# Altium schematic sheet Sheet1.SchDoc: DIY Supercapacitor Spot Welder – Inspired by AKA KASYAN, Modified Design
size A4; Author: Hisham2630; DrawnBy: Hisham2630; Engineer: Hisham2630; Revision: A; SheetNumber: 1; SheetTotal: 1
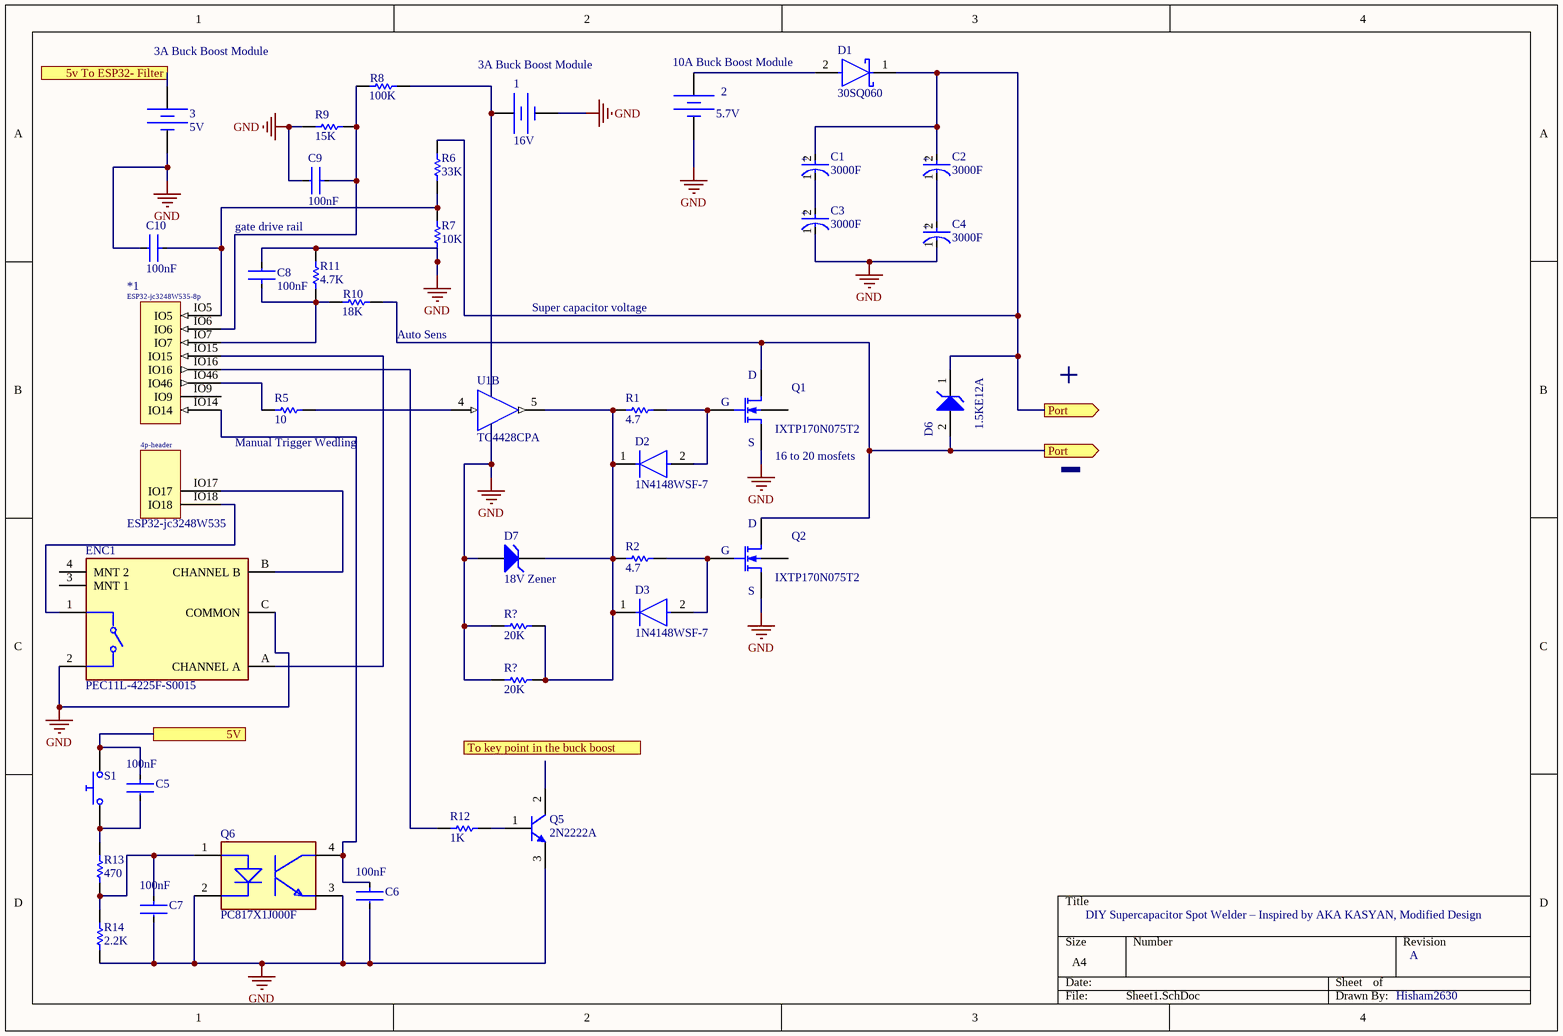
[diagram p0: Sheet1.SchDoc]

## Parts
(Parts that share a designator on the sheet are numbered #1, #2 ... from top to bottom, then left to right.)
1  3A Buck Boost Module  DC Magnitude: 16V
2  10A Buck Boost Module  DC Magnitude: 5.7V
3  3A Buck Boost Module  DC Magnitude: 5V
*1  ESP32-jc3248W535
C1  3000F  [FP-FT0H474ZF-MFG]
C2  3000F  [FP-FT0H474ZF-MFG]
C3  3000F  [FP-FT0H474ZF-MFG]
C4  3000F  [FP-FT0H474ZF-MFG]
C5  Capacitance: 100nF  [FP-GRM033-0_03-IPC_C]
C6  Capacitance: 100nF  [FP-GRM033-0_03-IPC_C]
C7  Capacitance: 100nF  [FP-GRM033-0_03-IPC_C]
C8  Capacitance: 100nF  [FP-GRM033-0_03-IPC_C]
C9  Capacitance: 100nF  [FP-GRM033-0_03-IPC_C]
C10  Capacitance: 100nF  [FP-GRM033-0_03-IPC_C]
D1  30SQ060  [FP-SMAF-MFG]
D2  1N4148WSF-7  [FP-SOD323F-MFG]
D3  1N4148WSF-7  [FP-SOD323F-MFG]
D6  1.5KE12A  [WE-TVSP_DO-214AA_Unidirectional]
D7  BV: 18V Zener  (hidden comment: Zener Diode)
ENC1  PEC11L-4225F-S0015  [FP-PEC11L-4225F-S0015-MFG]
Q1  IXTP170N075T2
Q2  IXTP170N075T2
Q5  2N2222A  [STM-TO-18-3]
Q6  PC817X1J000F  [FP-PC817X1J000F-MFG]
R1  value 4.7  (hidden comment: Resistor)
R2  value 4.7  (hidden comment: Resistor)
R5  value 10  (hidden comment: Resistor)
R6  value 33K  (hidden comment: Resistor)
R7  value 10K  (hidden comment: Resistor)
R8  value 100K  (hidden comment: Resistor)
R9  value 15K  (hidden comment: Resistor)
R10  value 18K  (hidden comment: Resistor)
R11  value 4.7K  (hidden comment: Resistor)
R12  value 1K  (hidden comment: Resistor)
R13  value 470  (hidden comment: Resistor)
R14  value 2.2K  (hidden comment: Resistor)
R?#1  value 20K  (hidden comment: Resistor)
R?#2  value 20K  (hidden comment: Resistor)
S1  Push Button Normally Opened  (value not drawn)
U1  TC4428CPA  [PDIP300-PA8]  (part B of 3)

## Ports
5V, 5v To ESP32- Filter, Port (out, see Sheet1[3B]), To key point in the buck boost

## Nets
GND: 1.2 2.2 3.2 C3.1(C) C4.1(C) C6.2 C7.2 C8.2 C9.2 C10.2 D7.1(A) ENC1.2 ENC1.C(COMMON) Q1.3(S) Q2.3(S) Q5.3(E) Q6.2(C) Q6.3(E) R7.1 R9.2 R11.2 R14.1 R?#1.1 R?#2.1
5V: C5.1 S1.2 ; port 5V
5v To ESP32- Filter: 3.1 ; port 5v To ESP32- Filter
Port: C1.2(A) C2.2(A) D1.1(C) D6.1(K) D6.2(A) Q1.1(D) Q2.1(D) R6.2 R10.2 ; port Port
Net1_1: 1.1 R8.2
Net2_1: 2.1 D1.2(A)
Net*1_IO5: *1.IO5 C10.1 R6.1 R7.2
Net*1_IO6: *1.IO6 C9.1 R8.1 R9.1
Net*1_IO7: *1.IO7 C8.1 R10.1 R11.1
Net*1_IO14: *1.IO14 C6.1 Q6.4(C)
Net*1_IO15: *1.IO15 ENC1.A(CHANNEL_A)
Net*1_IO16: *1.IO16 R12.1
Net*1_IO17: *1.IO17 ENC1.B(CHANNEL_B)
Net*1_IO18: *1.IO18 ENC1.1
Net*1_IO46: *1.IO46 R5.1
NetC1_1: C1.1(C) C3.2(A)
NetC2_1: C2.1(C) C4.2(A)
NetC5_2: C5.2 R13.2 S1.1
NetC7_1: C7.1 Q6.1(A) R13.1 R14.2
NetD2_1: D2.1(C) D3.1(C) D7.2(K) R1.1 R2.1 R?#1.2 R?#2.2 U1.5(OUTB)
NetD2_2: D2.2(A) Q1.2(G) R1.2
NetD3_2: D3.2(A) Q2.2(G) R2.2
NetQ5_1: Q5.1(B) R12.2
NetR5_2: R5.2 U1.4(INB)

Not connected (* = marked no-connect by the designer): *1 IO9; ENC1 3(MNT_1) 4(MNT_2); Q1 4(B); Q2 4(B); Q5 2(C)

## Notes on the sheet
- gate drive rail
- Super capacitor voltage
- (near R10) Auto Sens
- (near Q1) D
- (near R5) Manual Trigger Wedling
- (near Q1) G
- (near Q1) S
- +
- (near Q1) 16 to 20 mosfets
- -
- (near Q2) G
- (near Q2) D
- (near Q2) S
- (in symbol CMP-03024-000001-1) +
- (in symbol ESP32-jc3248W535) ESP32-jc3248W535-8p; 4p-header

## Library data of the parts
1-3 = Battery: Constant Voltage Source; SimulationGenericComponent: True
C1-C4 = CMP-03024-000001-1: CAP 470MF -20% +80% 5.5V T/H; Manufacturer: KEMET; Manufacturer Part Number: FT0H474ZF; Capacitance: 0.47F; Tolerance: -20/+80%; Value: 0.47F; Octopart: https://octopart.com/ft0h474zf-kemet-30531665; Automotive: No; Device Class L3: Supercapacitors; Digikey Description: CAP 470MF -20% +80% 5.5V T/H; ComponentLink2Description: Datasheet; ComponentLink2URL: https://content.kemet.com/datasheets/KEM_S6014_FT.pdf; Device Class L1: Passive Components; Height: 13mm; Category: Cap; RoHS: TRUE; Lead Free: Yes; Temperature Range Low: -40°C; Temperature: -40°C to +85°C; Voltage Rating: 5.5V; Device Class L2: Capacitors; Package: FT0H474ZF; Mouser Description: Supercapacitors / Ultracapacitors 0.47F 5.5volts Radial Super Cap; Temperature Range High: +85°C
C5-C10 = CMP-2010-01264-2: Chip Multilayer Ceramic Capacitors for General Purpose, 0201, 0.10uF, X5R, 15%, 10%, 10V; Mount: Surface Mount; Dielectric: X5R; Width: 0.012inch; Tolerance: 10%; Radiation Hardening: No; Voltage Rating: 10V; REACH SVHC: No SVHC; Height: 0.3mm; Max Operating Temperature: 85°C; Voltage Rating (DC): 10V; Thickness: 0.013inch; Termination: SMD/SMT; Lead Free: Lead Free; Package Quantity: 1; Case/Package: 0201; Min Operating Temperature: -55°C; Weight: 6E-06oz; Length: 0.6mm; Case Code (Imperial): 0201; Depth: 0.3mm; Voltage: 10V; Packaging: Tape and Reel; Case Code (Metric): 0603
D1 = CMP-12790-000092-1: DIODE SCHOTTKY 20V 1A SMAF; Average Rectified Current: 1A; Packaging: Tape and Reel; Mount: Surface Mount; Max Reverse Voltage (DC): 20V; RoHS Compliant: Yes
D2 D3 = CMP-12791-000029-1: DIODE GEN PURP 100V 250MA SOD323; Manufacturer: Diodes Inc.; Value: 1.5pF; Max Surge Forward Current: 0.5A; Peak Reverse Current: 0.5uA; Max Junction Temp: +150°C; Height: 0.75mm; Digikey Description: DIODE GEN PURP 100V 250MA SOD323; Automotive: No; Footprint Url: https://www.diodes.com/assets/Package-Files/SOD323F.pdf; Category: Diode; Manufacturer Part Number: 1N4148WSF-7; Max Repetitive Reverse Voltage: 100V; Lead Free: Yes; Temperature Range High: +150°C; Forward Current: 250mA; Reverse Voltage: 100V; Device Class L3: Rectifier Diodes; ComponentLink2URL: https://www.diodes.com/assets/Datasheets/1N4148WSF.pdf; Package: SOD323F; RoHS: TRUE; Mouser Description: Diodes - General Purpose, Power, Switching 200mW 2pF 75Vrrm 150mA 2A 1VF; Temperature: -55°C to +150°C; Capacitance: 1.5pF; Device Class L2: Diodes; ComponentLink2Description: Datasheet; Device Class L1: Discrete Semiconductors; Octopart: https://octopart.com/1n4148wsf-7-diodes+inc.-33798544; Temperature Range Low: -55°C
D6 = CMP-03913-71101605-2: TVS diode [Würth Elektronik] 824520700 TVS diode; Min Breakdown Voltage: 8.19V; Peak Pulse Current: 50A; Reverse Standoff Voltage: 7V; Power Line Protection: No; Number of Unidirectional Channels: 1; Polarity: Unidirectional; Peak Pulse Power: 600W; Leakage Current: 200µA; Clamping Voltage: 12V; Packaging: Cut Tape; Length: 4.32mm; Number of Pins: 2; Width: 3.62mm; Height: 2.4mm; REACH SVHC: Unknown; Breakdown Voltage: 8.19V; RoHS: Compliant; Composition: Zener; Mount: Surface Mount; Max Operating Temperature: 150°C; Min Operating Temperature: -65°C; Max Breakdown Voltage: 8.19V
D7 = Zener Diode: AF: 1; BV_MAX: 1e99; CJO: 0; EG: 1.11; FC: 0.5; IBV: 0.001; IS: 1e-14; MJSW: 0.33; NTUN: 30; TNOM: 27; XTI: 3; SimulationGenericComponent: True; CJP: 0; CTA: 0; CTP: 0; FCS: 0.5; FV_MAX: 1e99; IKF: 0; IKR: 0; ISR: 1e-14; JSW: 0; JTUN: 0; JTUNSW: 0; KEG: 1; KF: 0; LEVEL: 1; N: 1; NBV: 1; NR: 1; NS: 1; PHP: 1; RS: 0; TCV: 0; TLEV: 0; TLEVC: 0; TM1: 0; TM2: 0; TPB: 0; TPHP: 0; TRS: 0; TRS2: 0; TT: 0; TTT1: 0; TTT2: 0; VJ: 1; XTITUN: 3
ENC1 = CMP-07421-000017-1: ROTARY ENCODER MECHANICAL 15PPR; Capacitance: 4225F; Pulses per Revolution: 15; Built in Switch: Yes; Number of Channels: 2; Output Type: Quadrature; Length: 29.5mm; Height: 12mm; RoHS Compliant: Yes; Min Operating Temperature: -25°C; Package Quantity: 75; Detent: Yes; Encoder Type: Mechanical; Mount: Through Hole; Max Operating Temperature: 80°C; Orientation: Vertical; Termination: PC Pin; Width: 11.8mm; Packaging: Bulk
Q1 Q2 = MOSFET N-ch Lev1: N-channel MOS1 MOSFET Shichman and Hodges Model; CBD: 0; FC: 0.5; IS: 1e-14; KP: 2e-05; PB: 0.8; PHI: 0.6; TNOM: 27; SimulationGenericComponent: True; CBS: 0; CGBO: 0; CGDO: 0; CGSO: 0; CJ: 0; CJSW: 0; GAMMA: 0; JS: 0; LAMBDA: 0; LD: 0; MJ: 0.5; MJSW: 0.5; NSS: 0; NSUB: 0; RD: 0; RS: 0; RSH: 0; TOX: 0; TPG: 0; U0: 0; VTO: 0
Q5 = CMP-2000-05381-1: High Speed Switch, 0.6 A IC, -65 to 175 degC, 3-Pin TO-18, RoHS, Bulk; Manufacturer: STMicroelectronics; Power Dissipation Pd: 500mW; DC Current Gain hFE: 300hFE; Transistor Polarity: NPN; DC Collector Current: 600mA; No. of Pins: 3Pins; Transition Frequency ft: 300MHz; Collector Emitter Voltage V(br)ceo: 40V; Product Range: -; Package Reference: TO-18-3; Datasheet URL: https://datasheet.ciiva.com/25917/cd00003223-25917094.pdf; Automotive Qualification Standard: -; Transistor Case Style: TO-18; Operating Temperature Max: 175degC; Datasheet Version: Feb-03; Package Description: 3-Pin Through Hole Device, Dia 5.8 mm, Pitch 1.27 mm; Manufacturer URL: http://www.st.com/
Q6 = CMP-65434-000003-1: OPTOISOLATOR 5KV TRANS 4DIP; Collector Emitter Saturation Voltage: 200mV; Forward Voltage: 1.4V; Power Dissipation: 200mW; Input Current: 20mA; Max Collector Current: 50mA; Collector Emitter Breakdown Voltage: 80V; Rise Time: 18000ns; Number of Elements: 1; Reverse Breakdown Voltage: 6V; Current Transfer Ratio: 600%; Min Operating Temperature: -30°C; Number of Pins: 4; Radiation Hardening: No; Output Current per Channel: 50mA; Case/Package: DIP; Fall Time: 18000ns; Forward Current: 50mA; Isolation Voltage: 5kV; Package Quantity: 2000; Max Operating Temperature: 100°C; Packaging: Sleeve; Max Input Current: 50mA; Output Voltage: 80V; Max Power Dissipation: 200mW; Mount: Through Hole; Number of Channels: 1; Collector Emitter Voltage (VCEO): 80V
R1 R2 R5-R14 R?#1 R?#2 = Resistor: TC1: 0; SimulationGenericComponent: True; TC2: 0
S1 = Push Button NO: closed: 0; Rclosed: 1m; Ropen: 1Meg; SimulationGenericComponent: True
U1 = CMP-0137-00095-1: 1.5A Dual High-Speed Power MOSFET Driver, Complementary, Commercial Temperature; PackageVersion: revBB, Aug-2009; PackageReference: PDIP300-PA8; Code_JEDEC: MS-001-BA; PackageDescription: 8-Lead Plastic Dual In-Line (PA) - 300 mil Body [PDIP]; DatasheetVersion: revD, Jan-2006